# EAGLE schematic noise_lev (EAGLE 9.0.0)
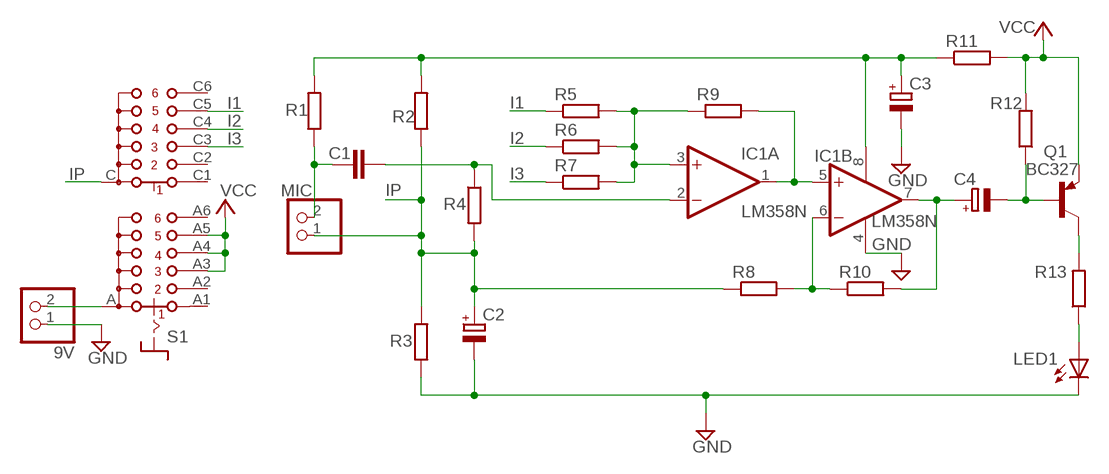
[diagram p0: schematic, sheet 1]

## Parts
9V  PINHD-1X2  [1X02]
C1  C-EU025-025X050  [C025-025X050]
C2  CPOL-EUE2.5-5  [E2,5-5]
C3  CPOL-EUE5-10.5  [E5-10,5]
C4  CPOL-EUE2.5-5  [E2,5-5]
IC1  LM358N  [DIL08]
LED1  LED5MM  [LED5MM]
MIC  PINHD-1X2  [1X02]
Q1  BC327  [TO92-EBC]
R1  R-EU_0207/10  [0207/10]
R2  R-EU_0207/10  [0207/10]
R3  R-EU_0207/10  [0207/10]
R4  R-EU_0207/10  [0207/10]
R5  R-EU_0207/10  [0207/10]
R6  R-EU_0207/10  [0207/10]
R7  R-EU_0207/10  [0207/10]
R8  R-EU_0207/10  [0207/10]
R9  R-EU_0207/10  [0207/10]
R10  R-EU_0207/10  [0207/10]
R11  R-EU_0207/10  [0207/10]
R12  R-EU_0207/10  [0207/10]
R13  R-EU_0207/10  [0207/10]
S1  CK102X06  [CK102X06]

## Nets
GND: 9V.1 C2.- C3.- IC1.4(P:V-) LED1.K(C) R3.1
I1: R5.1 S1.C5
I2: R6.1 S1.C4
I3: R7.1 S1.C3
IP: C2.+ MIC.1 R2.1 R3.2 R4.2 R8.1 S1.C
N$1: IC1.3(A:+IN) R5.2 R6.2 R7.2 R9.1
N$2: Q1.C R13.2
N$3: LED1.A R13.1
N$4: IC1.1(A:OUT) IC1.5(B:+IN) R9.2
N$5: C4.- Q1.B R12.1
N$7: 9V.2 S1.A
N$8: IC1.6(B:-IN) R8.2 R10.1
N$9: C1.2 IC1.2(A:-IN) R4.1
N$10: C1.1 MIC.2 R1.1
N$11: C4.+ IC1.7(B:OUT) R10.2
N$12: C3.+ IC1.8(P:V+) R1.2 R2.2 R11.1
VCC: Q1.E R11.2 R12.2 S1.A3 S1.A4 S1.A5
Unconnected: S1.A1 S1.A2 S1.A6 S1.C1 S1.C2 S1.C6

## Library data of the parts
9V MIC = pinhead:PINHD-1X2: PIN HEADER
C1 = rcl:C-EU: CAPACITOR, European symbol; SPICEPREFIX: C
C2-C4 = rcl:CPOL-EU: POLARIZED CAPACITOR, European symbol; SPICEPREFIX: C
IC1 = linear:LM358: OP AMP also LM158; LM258; LM2904 Source: http://cache.national.com/ds/LM/LM158.pdf
LED1 = led:LED: LED OSRAM: - CHIPLED LG R971, LG N971, LY N971, LG Q971, LY Q971, LO R971, LY R971 LH N974, LH R974 LS Q976, LO Q976, LY Q976 LO Q996 - Hyper CHIPLED LW Q18S LB Q993, LB Q99A, LB R99A - SideLED LS A670, LO A670, LY A670, LG A670, LP A670 LB A673, LV A673, LT A673, LW A673 LH A674 LY A675 LS A676, LA A676, LO A676, LY A676, LW A676 LS A679, LY A679, LG A679 - Hyper Micro SIDELED® LS Y876, LA Y876, LO Y876, LY Y876 LT Y87S - SmartLED LW L88C, LW L88S LB L89C, LB L89S, LG L890 LS L89K, LO L89K, LY L89K LS L896, LA L896, LO L896, LY L896 - TOPLED LS T670, LO T670, LY T670, LG T670, LP T670 LSG T670, LSP T670, LSY T670, LOP T670, LYG T670 LG T671, LOG T671, LSG T671 LB T673, LV T673, LT T673, LW T673 LH T674 LS T676, LA T676, LO T676, LY T676, LB T676, LH T676, LSB T676, LW T676 LB T67C, LV T67C, LT T67C, LS T67K, LO T67K, LY T67K, LW E67C LS E67B, LA E67B, LO E67B, LY E67B, LB E67C, LV E67C, LT E67C LW T67C LS T679, LY T679, LG T679 LS T770, LO T770, LY T770, LG T770, LP T770 LB T773, LV T773, LT T773, LW T773 LH T774 LS E675, LA E675, LY E675, LS T675 LS T776, LA T776, LO T776, LY T776, LB T776 LHGB T686 LT T68C, LB T68C - Hyper Mini TOPLED® LB M676 - Mini TOPLED Santana® LG M470 LS M47K, LO M47K, LY M47K Source: http://www.osram.convergy.de LUXEON: - LUMILED® LXK2-PW12-R00, LXK2-PW12-S00, LXK2-PW14-U00, LXK2-PW14-V00 LXK2-PM12-R00, LXK2-PM12-S00, LXK2-PM14-U00 LXK2-PE12-Q00, LXK2-PE12-R00, LXK2-PE12-S00, LXK2-PE14-T00, LXK2-PE14-U00 LXK2-PB12-K00, LXK2-PB12-L00, LXK2-PB12-M00, LXK2-PB14-N00, LXK2-PB14-P00, LXK2-PB14-Q00 LXK2-PR12-L00, LXK2-PR12-M00, LXK2-PR14-Q00, LXK2-PR14-R00 LXK2-PD12-Q00, LXK2-PD12-R00, LXK2-PD12-S00 LXK2-PH12-R00, LXK2-PH12-S00 LXK2-PL12-P00, LXK2-PL12-Q00, LXK2-PL12-R00 Source: www.luxeon.com KINGBRIGHT: KA-3528ASYC Source: www.kingbright.com
Q1 = transistor-pnp:BC327*: PNP Transistror
R1-R13 = rcl:R-EU_: RESISTOR, European symbol; SPICEPREFIX: R
S1 = switch:CK102X06: ROTARY SWITCH C&K